# EAGLE design shiva (EAGLE 7.3.0)
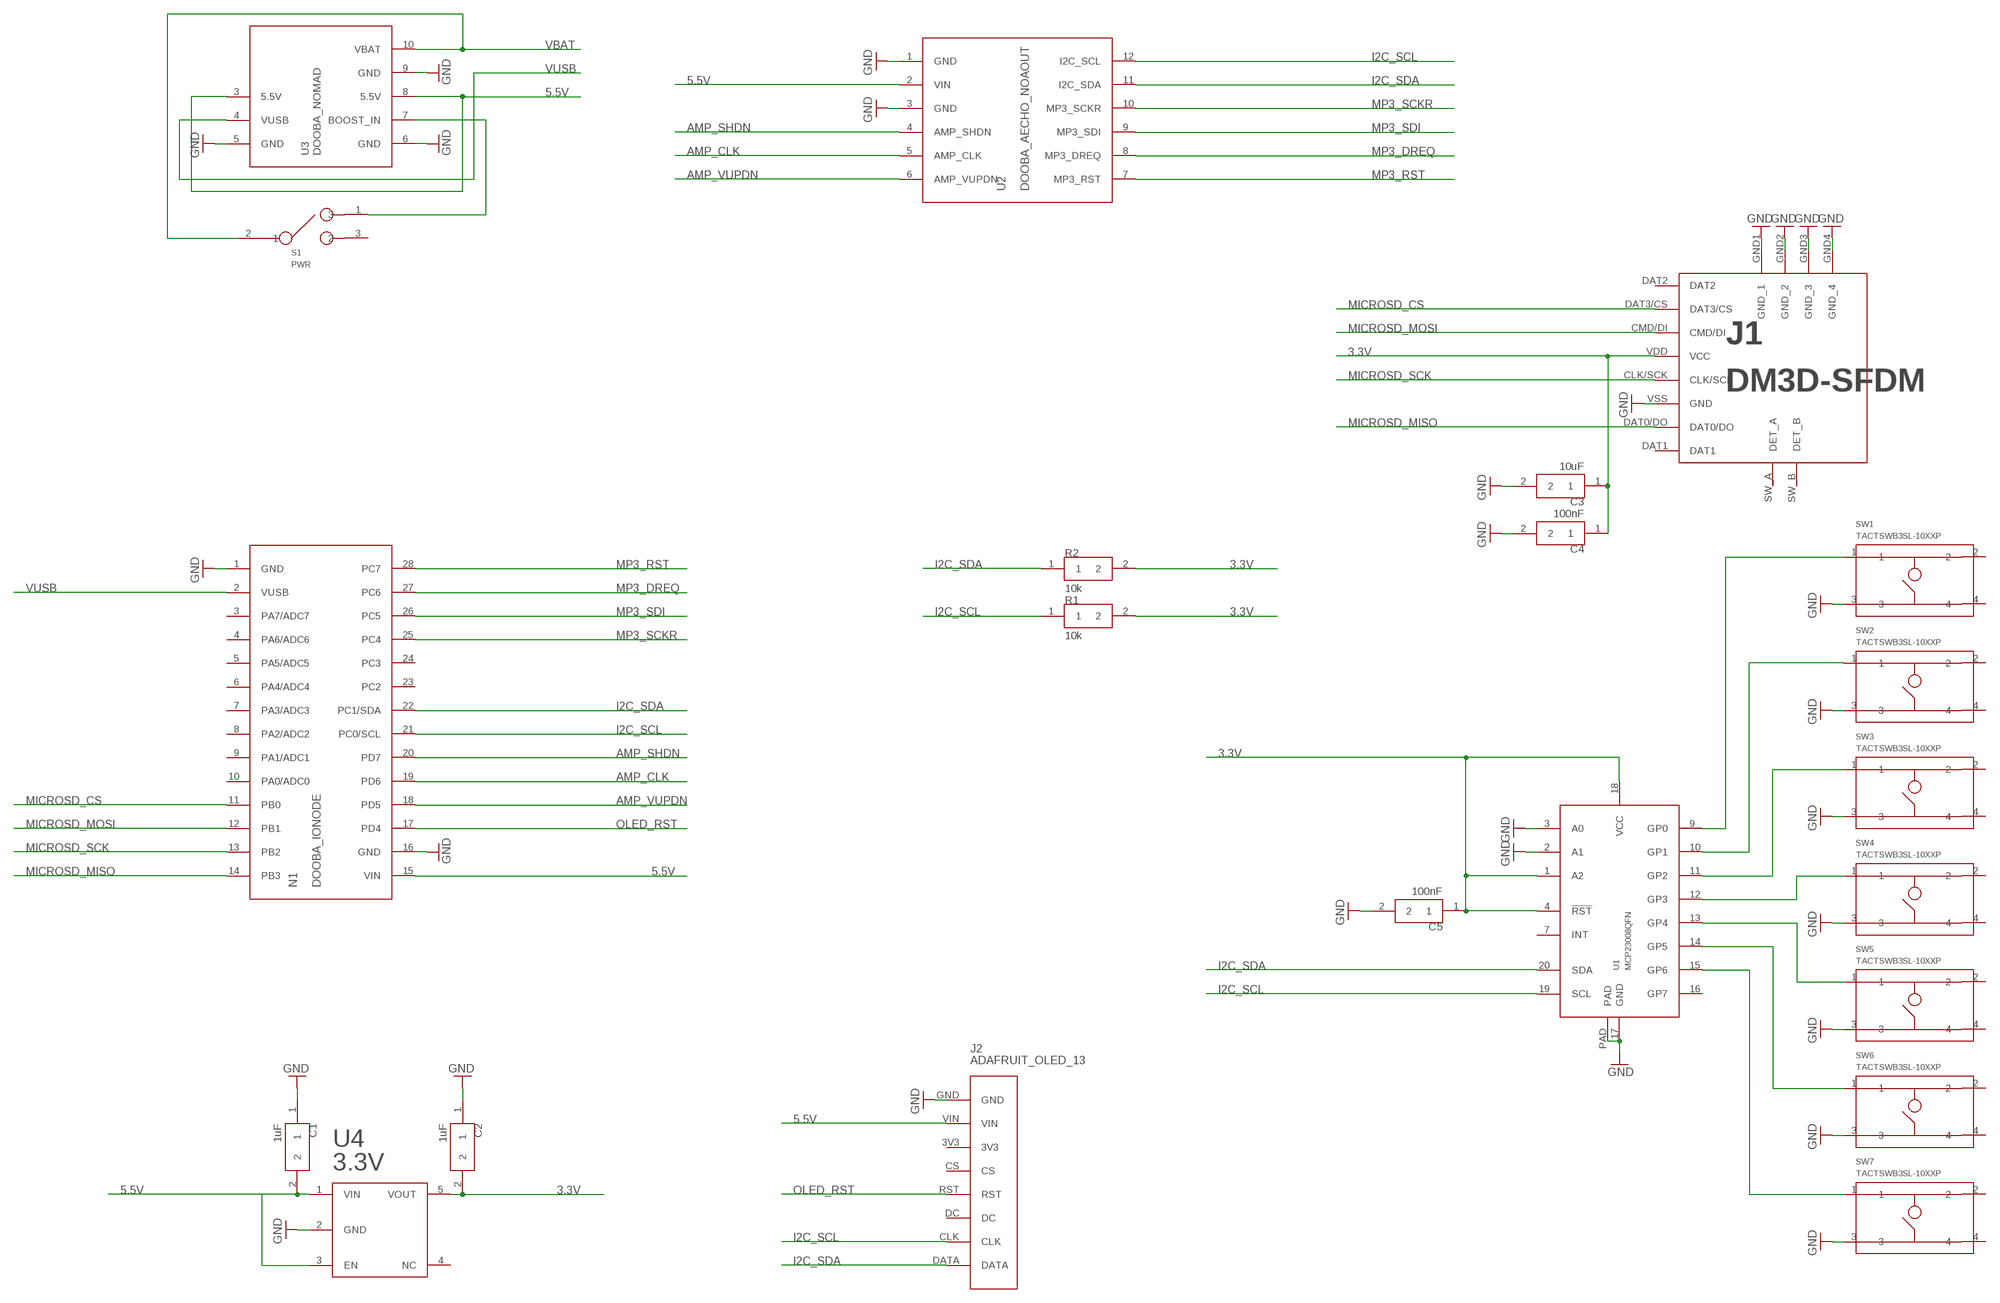
[diagram p0: schematic, sheet 1]

## Parts
C1  1uF  CAP0805  [0805]
C2  1uF  CAP0805  [0805]
C3  10uF  CAP0805  [0805]
C4  100nF  CAP0805  [0805]
C5  100nF  CAP0805  [0805]
J1  DM3D-SFDM  [DM3D-SF]
J2  ADAFRUIT_OLED_13  [ADAFRUIT_OLED_13]
N1  DOOBA_IONODE  [DOOBA_IONODE]
R1  10k  RES0805  [0805]
R2  10k  RES0805  [0805]
S1  PWR  SWITCH_SPDT  [JS102011]
SW1  TACTSWB3SL-10XXP  [B3SL-10XXP]
SW2  TACTSWB3SL-10XXP  [B3SL-10XXP]
SW3  TACTSWB3SL-10XXP  [B3SL-10XXP]
SW4  TACTSWB3SL-10XXP  [B3SL-10XXP]
SW5  TACTSWB3SL-10XXP  [B3SL-10XXP]
SW6  TACTSWB3SL-10XXP  [B3SL-10XXP]
SW7  TACTSWB3SL-10XXP  [B3SL-10XXP]
U1  MCP23008QFN  [20-VQFN]
U2  DOOBA_AECHO_NOAOUT  [DOOBA_AECHO_NOAOUT]
U3  DOOBA_NOMAD  [DOOBA_NOMAD]
U4  3.3V  LP3985SOT23-5  [SOT23-5]

## Nets
3.3V: C2.2 C3.1 C4.1 C5.1 J1.VDD(VCC) R1.2 R2.2 U1.1(A2) U1.4(!RST) U1.18(VCC) U4.5(VOUT)
5.5V: C1.2 J2.VIN N1.15(VIN) U2.2(VIN) U3.3(5.5V) U3.8(5.5V) U4.1(VIN) U4.3(EN)
AMP_CLK: N1.19(PD6) U2.5(AMP_CLK)
AMP_SHDN: N1.20(PD7) U2.4(AMP_SHDN)
AMP_VUPDN: N1.18(PD5) U2.6(AMP_VUPDN)
GND: C1.1 C2.1 C3.2 C4.2 C5.2 J1.GND1(GND_1) J1.GND2(GND_2) J1.GND3(GND_3) J1.GND4(GND_4) J1.VSS(GND) J2.GND N1.1(GND) N1.16(GND) SW1.3 SW2.3 SW3.3 SW4.3 SW5.3 SW6.3 SW7.3 U1.2(A1) U1.3(A0) U1.17(GND) U1.PAD U2.1(GND) U2.3(GND) U3.5(GND) U3.6(GND) U3.9(GND) U4.2(GND)
I2C_SCL: J2.CLK N1.21(PC0/SCL) R1.1 U1.19(SCL) U2.12(I2C_SCL)
I2C_SDA: J2.DATA N1.22(PC1/SDA) R2.1 U1.20(SDA) U2.11(I2C_SDA)
MICROSD_CS: J1.DAT3/CS N1.11(PB0)
MICROSD_MISO: J1.DAT0/DO N1.14(PB3)
MICROSD_MOSI: J1.CMD/DI N1.12(PB1)
MICROSD_SCK: J1.CLK/SCK N1.13(PB2)
MP3_DREQ: N1.27(PC6) U2.8(MP3_DREQ)
MP3_RST: N1.28(PC7) U2.7(MP3_RST)
MP3_SCKR: N1.25(PC4) U2.10(MP3_SCKR)
MP3_SDI: N1.26(PC5) U2.9(MP3_SDI)
N$1: SW1.1 U1.9(GP0)
N$2: SW2.1 U1.10(GP1)
N$3: SW3.1 U1.11(GP2)
N$4: SW4.1 U1.12(GP3)
N$5: SW5.1 U1.13(GP4)
N$6: SW6.1 U1.14(GP5)
N$7: SW7.1 U1.15(GP6)
N$11: S1.1 U3.7(BOOST_IN)
OLED_RST: J2.RST N1.17(PD4)
VBAT: S1.2 U3.10(VBAT)
VUSB: N1.2(VUSB) U3.4(VUSB)
Unconnected: J1.DAT1 J1.DAT2 J1.SW_A(DET_A) J1.SW_B(DET_B) J2.3V3 J2.CS J2.DC N1.3(PA7/ADC7) N1.4(PA6/ADC6) N1.5(PA5/ADC5) N1.6(PA4/ADC4) N1.7(PA3/ADC3) N1.8(PA2/ADC2) N1.9(PA1/ADC1) N1.10(PA0/ADC0) N1.23(PC2) N1.24(PC3) S1.3 SW1.2 SW1.4 SW2.2 SW2.4 SW3.2 SW3.4 SW4.2 SW4.4 SW5.2 SW5.4 SW6.2 SW6.4 SW7.2 SW7.4 U1.7(INT) U1.16(GP7) U4.4(NC)

## Library data of the parts
C1-C5 = dooba:CAP
J1 = dooba:DM3D-SF
J2 = dooba:ADAFRUIT_OLED_13
N1 = dooba:DOOBA_IONODE
R1 R2 = dooba:RES
S1 = dooba:SWITCH_SPDT
SW1-SW7 = dooba:TACTSW
U1 = dooba:MCP23008
U2 = dooba:DOOBA_AECHO_NOAOUT
U3 = dooba:DOOBA_NOMAD
U4 = dooba:LP3985

## Board
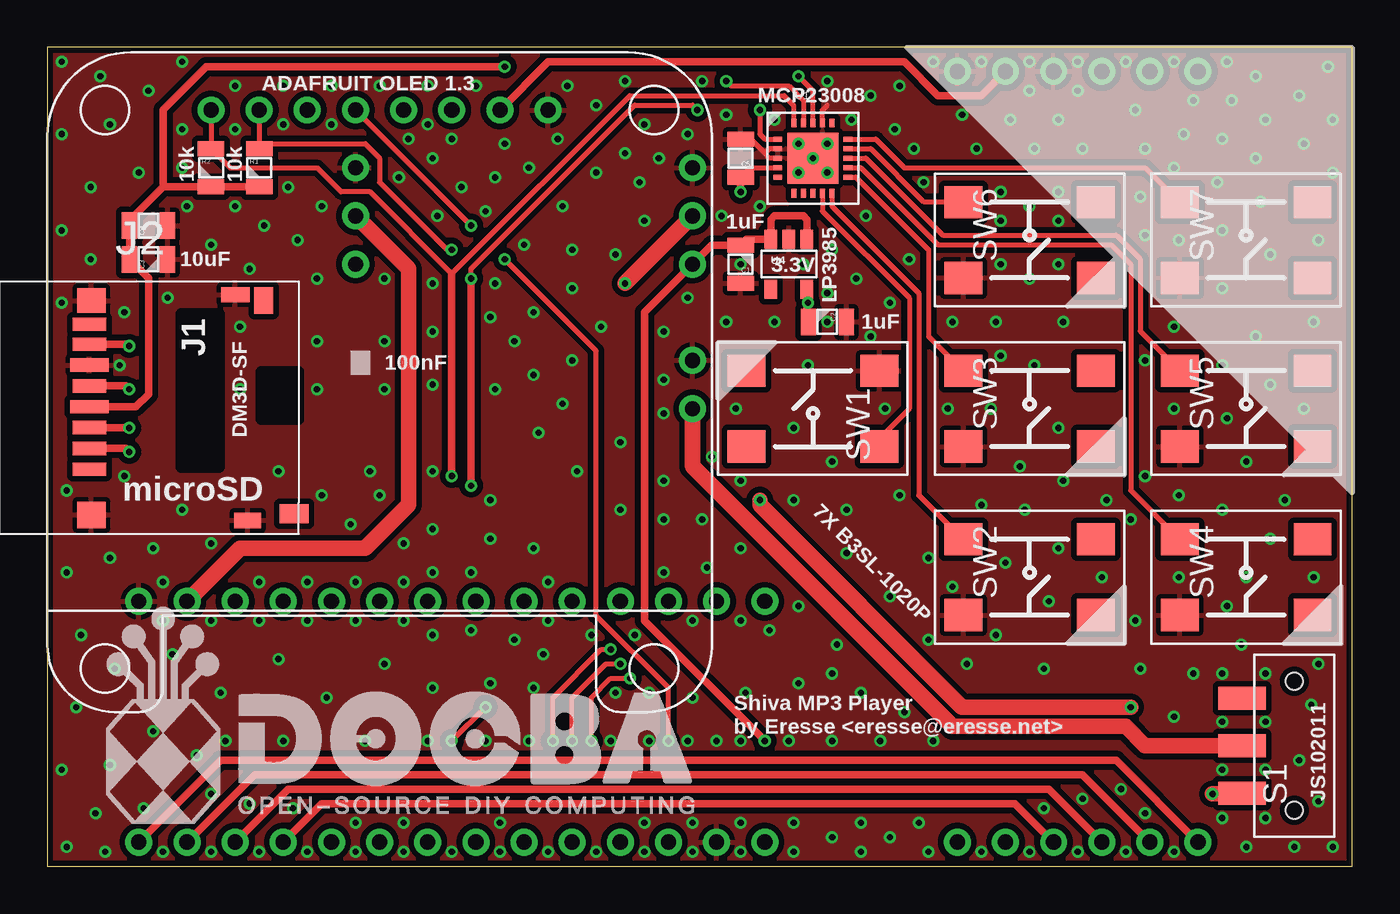
[diagram p1: board, top side]
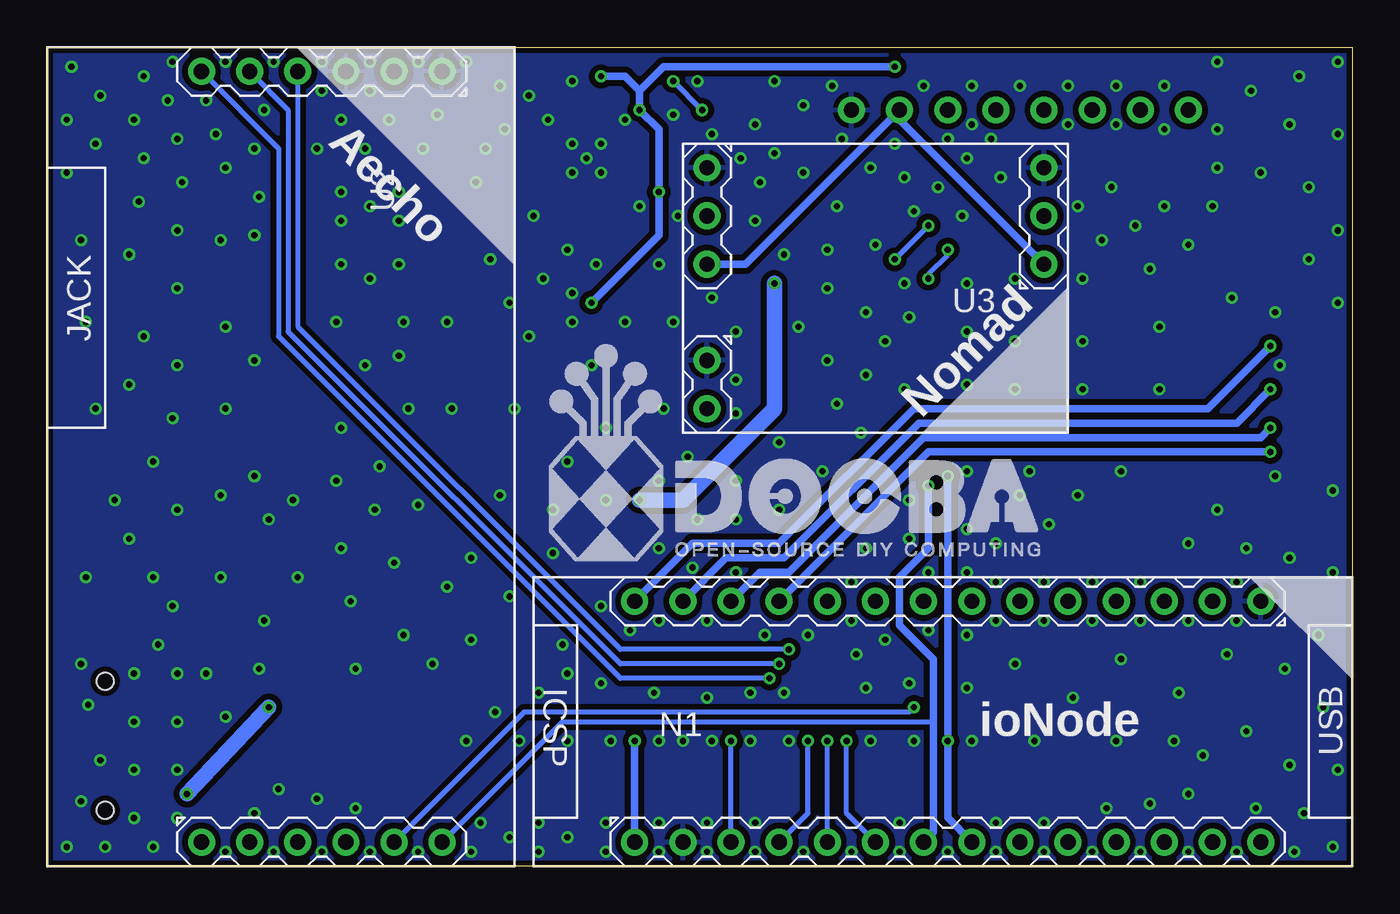
[diagram p2: board, bottom side, seen from below]

Size 68.83 x 43.18 mm. Coordinates in mm from the lower left corner, seen from the top.
Outline: 0,0 68.83,0 68.83,43.18 0,43.18 0,0
Copper layers (1*16): Top 0.035mm / dielectric 1.5mm / Bottom 0.035mm
Design rules "dooba *": minimum track width 6mil, minimum drill 13mil, track to track 6mil, track to pad 6mil, pad to pad 6mil, via to via 6mil, smd to smd 0mil, copper to edge 10mil, drill to drill 10mil, minimum pad ring 10mil, minimum via ring 6mil, stop-mask expansion 2mil, vias tented up to drill 25mil, thermal gap 10mil

### Footprints (pad centres in the part's own frame; a part is rotated, then mirrored left to right if it is on the bottom)
0805 = smd 0.8 x 1.4: 1 -1,0; 2 1,0
DM3D-SF = smd 0.7 x 1.75: CLK/SCK -1.2,-1.34; CMD/DI 1,-1.34; DAT0/DO -3.4,-1.34; DAT1 -4.45,-1.34; DAT2 3.2,-1.34; DAT3/CS 2.1,-1.34 | smd 0.8 x 1.5: GND1 -6,6.36 | smd 0.8 x 1.4: GND2 5.9,7.01 | smd 1.4 x 1.5: GND3 5.6,-1.24 | smd 1.3 x 1.5: GND4 -5.7,-1.24 | smd 1 x 1.55: SW_A 5.55,9.46 | smd 1.4 x 1: SW_B -5.7,7.86 | smd 0.7 x 2.032: VDD -0.1,-1.34; VSS -2.3,-1.34
ADAFRUIT_OLED_13 = drill 0.8 pad 1.422: 3V3 3.81,0; CLK -6.35,0; CS 1.27,0; DATA -8.89,0; DC -3.81,0; GND 8.89,0; RST -1.27,0; VIN 6.35,0
DOOBA_IONODE = drill 0.8 pad 1.422: 1 16.51,6.35; 2 13.97,6.35; 3 11.43,6.35; 4 8.89,6.35; 5 6.35,6.35; 6 3.81,6.35; 7 1.27,6.35; 8 -1.27,6.35; 9 -3.81,6.35; 10 -6.35,6.35; 11 -8.89,6.35; 12 -11.43,6.35; 13 -13.97,6.35; 14 -16.51,6.35; 15 -16.51,-6.35; 16 -13.97,-6.35; 17 -11.43,-6.35; 18 -8.89,-6.35; 19 -6.35,-6.35; 20 -3.81,-6.35; 21 -1.27,-6.35; 22 1.27,-6.35; 23 3.81,-6.35; 24 6.35,-6.35; 25 8.89,-6.35; 26 11.43,-6.35; 27 13.97,-6.35; 28 16.51,-6.35
JS102011 = smd 1.2 x 2.5: 1 -2.5,2.75; 2 0,2.75; 3 2.5,2.75 | hole 0.9: -3.4,0; 3.4,0
B3SL-10XXP = smd 2 x 1.7: 1 3.5,-2; 2 -3.5,-2; 3 3.5,2; 4 -3.5,2
20-VQFN = smd 0.45 x 0.26: 1 -1.85,1; 2 -1.85,0.5; 3 -1.85,0; 4 -1.85,-0.5; 5 -1.85,-1; 11 1.85,-1; 12 1.85,-0.5; 13 1.85,0; 14 1.85,0.5; 15 1.85,1 | smd 0.26 x 0.45: 6 -1,-1.85; 7 -0.5,-1.85; 8 0,-1.85; 9 0.5,-1.85; 10 1,-1.85; 16 1,1.85; 17 0.5,1.85; 18 0,1.85; 19 -0.5,1.85; 20 -1,1.85 | smd 2.7 x 2.7: PAD 0,0
DOOBA_AECHO_NOAOUT = drill 0.8 pad 1.422: 1 -20.32,6.35; 2 -20.32,3.81; 3 -20.32,1.27; 4 -20.32,-1.27; 5 -20.32,-3.81; 6 -20.32,-6.35; 7 20.32,-6.35; 8 20.32,-3.81; 9 20.32,-1.27; 10 20.32,1.27; 11 20.32,3.81; 12 20.32,6.35
DOOBA_NOMAD = drill 0.8 pad 1.422: 3 -8.89,-1.27; 4 -8.89,-3.81; 5 -8.89,-6.35; 6 8.89,-6.35; 7 8.89,-3.81; 8 8.89,-1.27; 9 8.89,3.81; 10 8.89,6.35
SOT23-5 = smd 0.66 x 1: 1 0.95,1.315; 2 0,1.315; 3 -0.95,1.315; 4 -0.95,-1.315; 5 0.95,-1.315

### Placement (x,y rotation side)
C1  36.58,31.75 90 top
C2  41.15,28.7 180 top
C3  5.33,32 0 top
C4  5.33,33.78 0 top
C5  36.58,37.34 90 top
J1  3.56,24.13 270 top
J2  17.53,39.88 0 top
N1  21.34,7.62 0 bottom
R1  11.18,36.83 270 top
R2  8.64,36.83 270 top
S1  65.79,6.35 90 top
SW1  40.39,24.13 0 top
SW2  51.82,15.24 180 top
SW3  51.82,24.13 180 top
SW4  63.25,15.24 180 top
SW5  63.25,24.13 180 top
SW6  51.82,33.02 180 top
SW7  63.25,33.02 180 top
U1  40.39,37.34 0 top
U2  54.36,21.59 270 bottom
U3  25.15,30.48 180 bottom
U4  39.12,31.75 0 top

### Tracks (layer width: path | path; a pad name or v marks a point on that pad's centre or on a via)
3.3V  (via drill 0.33)
  Top 0.254: C5.1 37.08,36.84 U1.4 | U1.18 40.39,40.89 v39.62,41.66 | v37.59,39.88 37.59,38.61 37.86,38.34 U1.1 | U4.5 40.13,30.37
  Top 0.406: U4.5 40.07,28.78 C2.2 | J1.VDD 4.67,24.23 5.33,24.89 5.33,31 C3.1 C4.1 4.32,33.8 4.32,34.04 6.11,35.83 | 6.11,35.83 R2.2 R1.2 | 40.13,30.37 v40.13,29.72 | v36.58,35.56 C5.1 | v24.13,42.16 8.38,42.16 6.11,39.89 6.11,35.83
  Bottom 0.406: v39.62,41.66 38.35,41.66 37.59,40.89 | 37.59,40.89 v37.59,39.88 36.58,38.86 v36.58,35.56 36.58,33.27 v40.13,29.72 | 37.59,40.89 36.32,42.16 v24.13,42.16
5.5V  (via drill 0.33)
  Top 0.406: U4.1 40.07,34.1 39.88,34.29 38.35,34.29 38.17,34.1 U4.3 36.89,33.06 C1.2 35.04,32.75 U3.8 31.5,29.21 31.5,12.95 v37.85,6.6 | U2.2 49.28,40.64 46.99,40.64 45.21,42.42 26.42,42.42 J2.VIN
  Bottom 0.406: U3.3 23.88,39.37 J2.VIN 32,31.75 U3.8 | N1.15 v37.85,6.6
AMP_CLK  (via drill 0.33)
  Top 0.254: v27.69,6.6 27.69,8.89 29.46,10.67 v30.23,10.67
  Bottom 0.254: N1.19 v27.69,6.6 | v30.23,10.67 38.61,10.67 56.13,28.19 56.13,39.88 U2.5
AMP_SHDN  (via drill 0.33)
  Top 0.254: v26.67,6.6 26.67,8.89 29.21,11.43 v29.72,11.43
  Bottom 0.254: N1.20 26.67,2.79 v26.67,6.6 | v29.72,11.43 38.61,11.43 55.63,28.45 U2.4
AMP_VUPDN  (via drill 0.33)
  Top 0.254: v28.7,6.6 28.7,8.89 29.72,9.91 v30.73,9.91
  Bottom 0.254: N1.18 28.7,2.79 v28.7,6.6 | v30.73,9.91 38.61,9.91 56.64,27.94 56.64,37.85 U2.6
GND  (via drill 0.33)
  Top 0.254: U1.17 40.89,39.87 41.15,40.13 | U1.2 38.09,37.84 37.85,37.59 | U1.3 38.1,37.34 37.85,37.59 | 37.85,37.59 37.08,38.35 36.58,38.35
  other vias: 29.72,6.6 31.75,6.6 29.97,9.14 31.75,9.14 33.78,6.6 36.58,6.6 35.31,6.6 34.04,8.89 30.99,12.19 28.7,12.19 34.04,12.95 38.1,12.45 36.83,9.14 39.62,9.65 42.93,9.14 45.21,8.13 46.74,6.6 41.66,11.68 41.4,10.16 39.12,6.6 41.4,6.6 43.94,6.6 39.37,0.76 46.48,0.76 39.37,2.29 45.97,2.29 41.4,1.52 44.45,1.52 42.93,2.29 42.93,0.76 25.4,6.6 23.11,6.6 25.65,9.4 23.37,9.65 31.5,2.29 34.04,2.29 36.58,2.29 23.88,2.29 18.8,2.29 16.26,2.29 12.95,3.05 10.67,3.3 8.64,3.81 5.08,3.05 7.87,5.84 9.4,6.6 20.07,6.6 12.45,6.6 16.76,6.6 20.32,9.4 20.32,12.19 6.1,12.95 8.64,12.95 11.18,12.95 13.72,12.95 16.26,12.95 18.8,12.95 26.42,12.95 36.58,12.95 17.78,10.67 14.73,8.89 12.19,10.92 9.14,9.14 6.6,11.18 5.59,7.11 3.56,10.41 3.3,5.33 2.54,2.79 1.78,12.19 1.52,8.38 0.76,5.08 1.02,1.02 3.05,0.76 1.02,15.49 6.1,14.99 11.18,14.99 13.72,14.99 16.26,14.99 18.8,14.99 26.42,14.99 22.35,12.45 22.35,15.49 24.64,11.94 26.16,11.18 23.37,19.3 23.37,17.27 25.65,16.76 20.32,15.49 20.32,17.78 20.32,25.4 20.32,20.83 18.8,17.02 8.64,17.02 3.3,16.26 5.59,16.76 7.11,18.8 4.06,20.57 16,18.03 17.53,19.56 12.19,20.83 17.02,20.83 14.48,19.56 10.16,25.15 14.22,25.15 17.78,25.15 17.78,27.69 17.78,30.99 20.32,28.19 20.32,30.73 14.22,27.69 14.22,30.99 10.16,28.45 6.35,29.97 4.06,29.21 3.81,26.42 0.76,29.72 1.02,19.81 0.76,33.53 0.76,38.61 2.29,35.81 2.29,32 4.83,36.58 5.33,40.89 3.3,39.12 7.37,34.8 9.91,34.8 9.91,38.86 12.7,35.81 14.48,34.8 13.21,33.02 8.64,32.77 11.43,33.78 10.67,31.5 7.11,38.86 7.11,36.83 9.91,41.15 12.45,41.15 14.99,41.15 17.53,41.15 20.07,41.15 22.61,41.15 12.45,39.12 14.99,39.12 20.07,39.12 24.13,38.1 21.84,35.81 23.11,34.54 25.4,36.83 23.62,36.32 26.92,38.35 20.32,37.34 19.05,38.35 21.34,38.35 18.54,36.32 20.57,34.29 23.62,30.73 27.69,26.67 27.94,20.83 23.62,25.15 25.91,22.86 24.64,27.69 27.18,24.38 25.65,29.21 23.37,28.96 25.65,25.91 30.23,18.8 30.23,22.35 29.21,28.45 25.15,32.77 27.18,34.8 29.97,32.26 27.69,30.48 27.69,32.51 27.43,41.15 34.54,41.4 30.48,41.4 28.96,40.13 31.5,39.12 28.96,36.58 31.5,34.04 35.81,39.62 35.56,34.29 37.59,34.8 38.35,39.37 33.78,38.61 31.24,36.07 32.26,37.34 30.48,37.59 33.78,29.97 32.51,28.19 32.51,23.88 32.51,25.65 35.81,28.7 32.51,20.32 32.51,18.29 34.54,18.29 36.58,16.76 39.62,13.72 42.16,16.51 39.37,19.3 44.96,19.56 42.16,18.8 35.05,21.59 36.58,20.32 36.32,24.13 44.2,24.13 40.13,26.42 39.37,23.11 41.4,21.34 38.35,28.7 41.15,28.7 43.43,27.94 44.45,29.72 41.4,32.51 41.15,30.23 42.67,30.99 39.88,31.75 36.58,31.75 43.18,34.29 45.47,32 46.23,36.07 45.72,37.85 42.42,39.37 44.7,38.86 41.15,41.4 44.96,41.15 43.43,40.64 48.26,39.62 49.02,37.85 51.82,40.89 54.36,40.89 54.61,37.85 52.07,37.85 53.34,39.37 50.8,39.37 57.4,39.88 57.91,37.85 60.45,40.39 62.23,42.42 59.94,38.61 59.44,36.83 62.48,40.39 61.98,38.35 61.72,36.07 50.29,35.56 53.34,35.56 53.34,34.04 50.29,34.04 51.82,34.8 51.82,30.99 50.04,28.7 47.75,28.7 53.59,28.7 47.5,24.13 49.78,24.13 52.07,26.42 50.29,26.92 50.29,31.75 53.34,31.75 53.34,23.11 49.28,19.05 51.31,21.08 51.56,18.8 53.59,20.32 57.15,18.29 55.88,19.3 44.45,14.22 46.48,16.26 46.48,11.94 48.51,10.67 47.75,14.73 50.04,12.19 50.55,16 52.83,13.97 55.63,15.24 53.34,16.76 57.4,12.95 52.58,10.41 57.66,10.41 59.44,7.87 62.99,11.68 60.45,10.16 61.98,5.08 64.26,5.08 64.26,7.62 61.98,7.62 61.98,2.54 64.26,2.54 61.98,10.16 64.26,10.16 63.25,1.02 65.79,1.02 66.04,5.59 66.68,8.51 67.06,10.67 67.06,3.43 49.28,0.76 51.82,0.76 54.36,0.76 56.9,0.76 59.44,0.76 52.58,3.05 54.61,3.56 56.64,4.06 57.91,2.79 6.1,0.76 8.64,0.76 11.18,0.76 13.72,0.76 16.26,0.76 18.8,0.76 21.34,0.76 23.88,0.76 26.42,0.76 28.96,0.76 31.5,0.76 34.04,0.76 36.58,0.76 49.28,42.42 46.74,42.42 51.82,42.42 54.36,42.42 56.9,42.42 59.44,42.42 32.51,15.49 34.8,15.75 59.69,15.24 66.8,15.24 63.25,15.24 62.23,13.72 64.52,17.27 59.69,19.56 61.98,18.8 65.28,19.3 59.44,24.13 57.91,26.67 57.91,20.57 61.98,26.42 63.25,21.34 62.23,23.62 64.52,25.4 66.29,24.13 63.75,27.94 59.44,28.45 66.8,28.7 61.98,30.48 64.52,32.26 59.69,33.02 57.66,35.31 57.91,33.27 67.06,33.02 64.01,35.05 61.98,33.53 63.75,37.34 64.26,39.37 63.75,41.66 67.56,42.16 66.04,40.64 66.29,38.1 67.82,39.37 67.82,36.58 67.82,1.02 0.76,42.42 2.79,41.66 7.11,42.42 39.62,38.1 41.15,38.1 41.15,36.58 39.62,36.58 40.39,37.34
  pour Top (isolate 0.305): 0,43.18 68.83,43.18 68.83,0 0,0
  pour Bottom (isolate 0.305): 0,43.18 68.83,43.18 68.83,0 0,0
I2C_SCL  (via drill 0.33)
  Top 0.254: J2.CLK R1.1 11.45,38.1 16.76,38.1 17.53,37.34 17.53,36.07 21.08,32.51 v21.34,32.51 | v22.35,30.99 22.35,31.5 30.99,40.13 34.04,40.13 v34.29,39.88 | v35.81,41.4 36.07,41.15 39.12,41.15 39.89,40.38 U1.19
  Top 0.406: v22.35,20.07 v22.35,30.99
  Bottom 0.254: v21.34,32.51 21.34,32.26 22.35,31.24 v22.35,30.99 | v34.29,39.88 v35.81,41.4 | U2.12 41.66,7.62 22.1,7.62
  Bottom 0.406: v22.35,20.07 22.35,16.76 23.88,15.24 23.88,12.7 22.1,10.92 22.1,7.62 22.1,1.78 N1.21
I2C_SDA  (via drill 0.33)
  Top 0.254: U1.20 39.39,40.12 38.86,40.64 30.73,40.64 21.34,31.24 17.02,35.56 15.49,35.56 14.22,36.83 9.64,36.83 R2.1 J2.DATA | v23.11,8.38 v21.34,6.6
  Top 0.406: v21.34,20.57 21.34,31.24
  Bottom 0.254: v23.11,8.38 23.37,8.13 43.69,8.13 U2.11
  Bottom 0.406: v21.34,20.57 v21.34,6.6 21.34,2.54 N1.22
MICROSD_CS  (via drill 0.33)
  Top 0.406: v4.32,21.84 4.13,22.03 J1.DAT3/CS
  Bottom 0.406: N1.11 22.35,21.84 v4.32,21.84
MICROSD_MISO  (via drill 0.33)
  Top 0.406: v4.32,27.43 4.22,27.53 J1.DAT0/DO
  Bottom 0.406: v4.32,27.43 7.62,24.13 23.11,24.13 30.23,17.02 34.8,17.02 N1.14
MICROSD_MOSI  (via drill 0.33)
  Top 0.406: v4.32,23.11 4.3,23.13 J1.CMD/DI
  Bottom 0.406: v4.32,23.11 4.83,22.61 22.61,22.61 29.72,15.49 31.24,15.49 N1.12
MICROSD_SCK  (via drill 0.33)
  Top 0.406: v4.32,25.15 4.13,25.33 J1.CLK/SCK
  Bottom 0.406: v4.32,25.15 6.1,23.37 22.86,23.37 29.97,16.26 33.02,16.26 N1.13
MP3_DREQ
  Top 0.406: N1.27 10.92,4.83 54.61,4.83 U2.8
MP3_RST
  Top 0.406: N1.28 9.14,5.59 56.39,5.59 U2.7
MP3_SCKR
  Top 0.406: N1.25 14.48,3.3 51.05,3.3 U2.10
MP3_SDI
  Top 0.406: N1.26 12.7,4.06 52.83,4.06 U2.9
N$1
  Top 0.254: SW1.1 43.89,22.55 45.47,24.13 45.47,29.97 40.89,34.55 U1.9
N$2
  Top 0.254: SW2.1 48.29,17.24 45.97,19.56 45.97,30.23 41.39,34.81 U1.10
N$3
  Top 0.254: SW3.1 48.29,26.13 46.48,27.94 46.48,32.51 42.66,36.34 U1.11
N$4
  Top 0.254: SW4.1 59.72,17.24 57.15,19.81 57.15,31.75 56.13,32.77 46.99,32.77 42.92,36.84 U1.12
N$5
  Top 0.254: U1.13 43.18,37.34 47.24,33.27 56.39,33.27 57.66,32 57.66,28.22 SW5.1
N$6
  Top 0.254: U1.14 43.44,37.84 46.23,35.05 48.28,35.05 SW6.1
N$7
  Top 0.254: U1.15 43.7,38.34 45.21,36.83 57.94,36.83 SW7.1
N$11  (via drill 0.33)
  Top 0.813: S1.1 63,3.81 v61.47,3.81 | v57.15,8.38 48.26,8.38 37.59,19.05 v37.59,19.3 | v30.48,30.73 U3.7
  Bottom 0.813: v61.47,3.81 v57.15,8.38 | v37.59,19.3 35.31,19.3 30.48,24.13 v30.48,30.73
OLED_RST  (via drill 0.33)
  Top 0.254: J2.RST v22.35,33.78 | v32.77,6.6 32.77,9.4 28.96,13.21 28.96,27.18 v24.13,32
  Bottom 0.254: N1.17 v32.77,6.6 | v22.35,33.78 v24.13,32
VBAT
  Top 0.813: U3.10 34.04,21.08 47.75,7.37 56.9,7.37 57.91,6.35 S1.2
VUSB
  Top 0.813: N1.2 10.16,16.76 16.76,16.76 19.05,19.05 19.05,31.5 U3.4

### Text on the board
tPlace: ADAFRUIT OLED 1.3 | MCP23008 | 10k | 10k | 1uF | 3.3V | 10uF | LP3985 | 1uF | 100nF | DM3D-SF | 7X B3SL-1020P | Shiva MP3 Player / by Eresse <eresse@eresse.net> | JS102011
bPlace: Aecho | Nomad | ioNode